# Altium schematic sheet schematics.SchDoc (part 1 of 3)
size A2
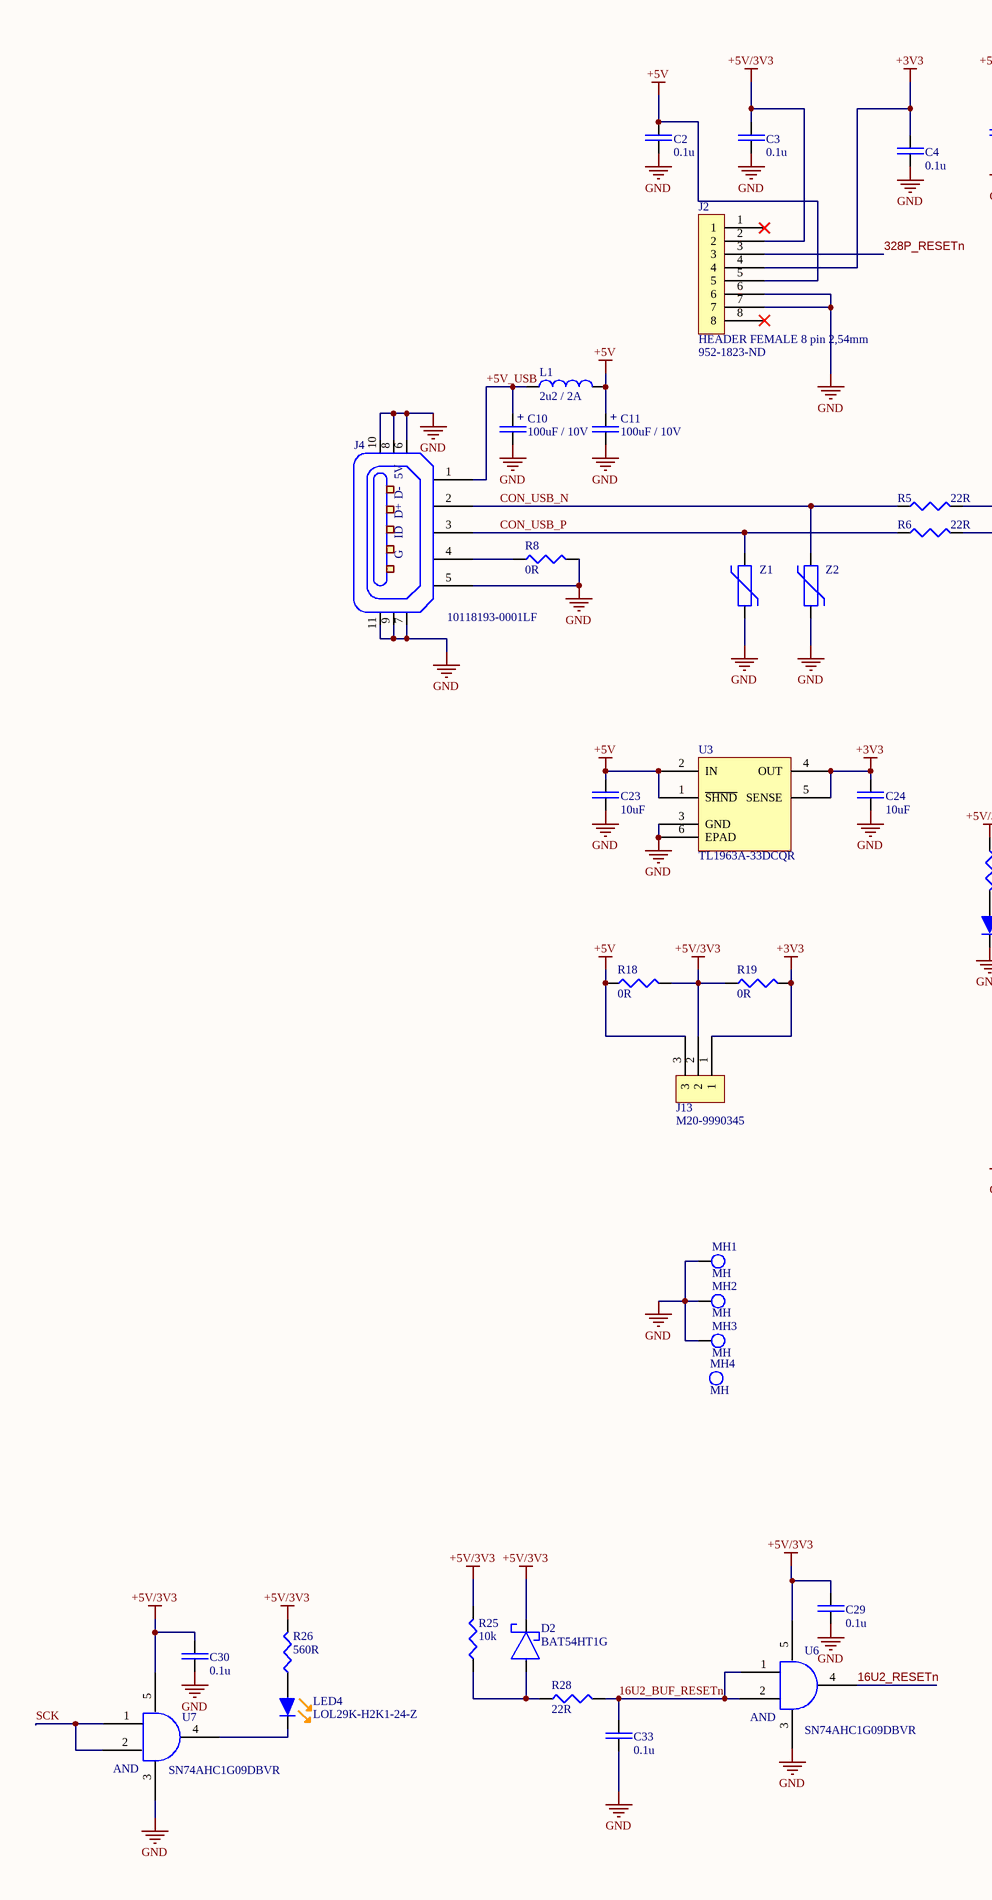
[diagram p0: schematics.SchDoc, left]
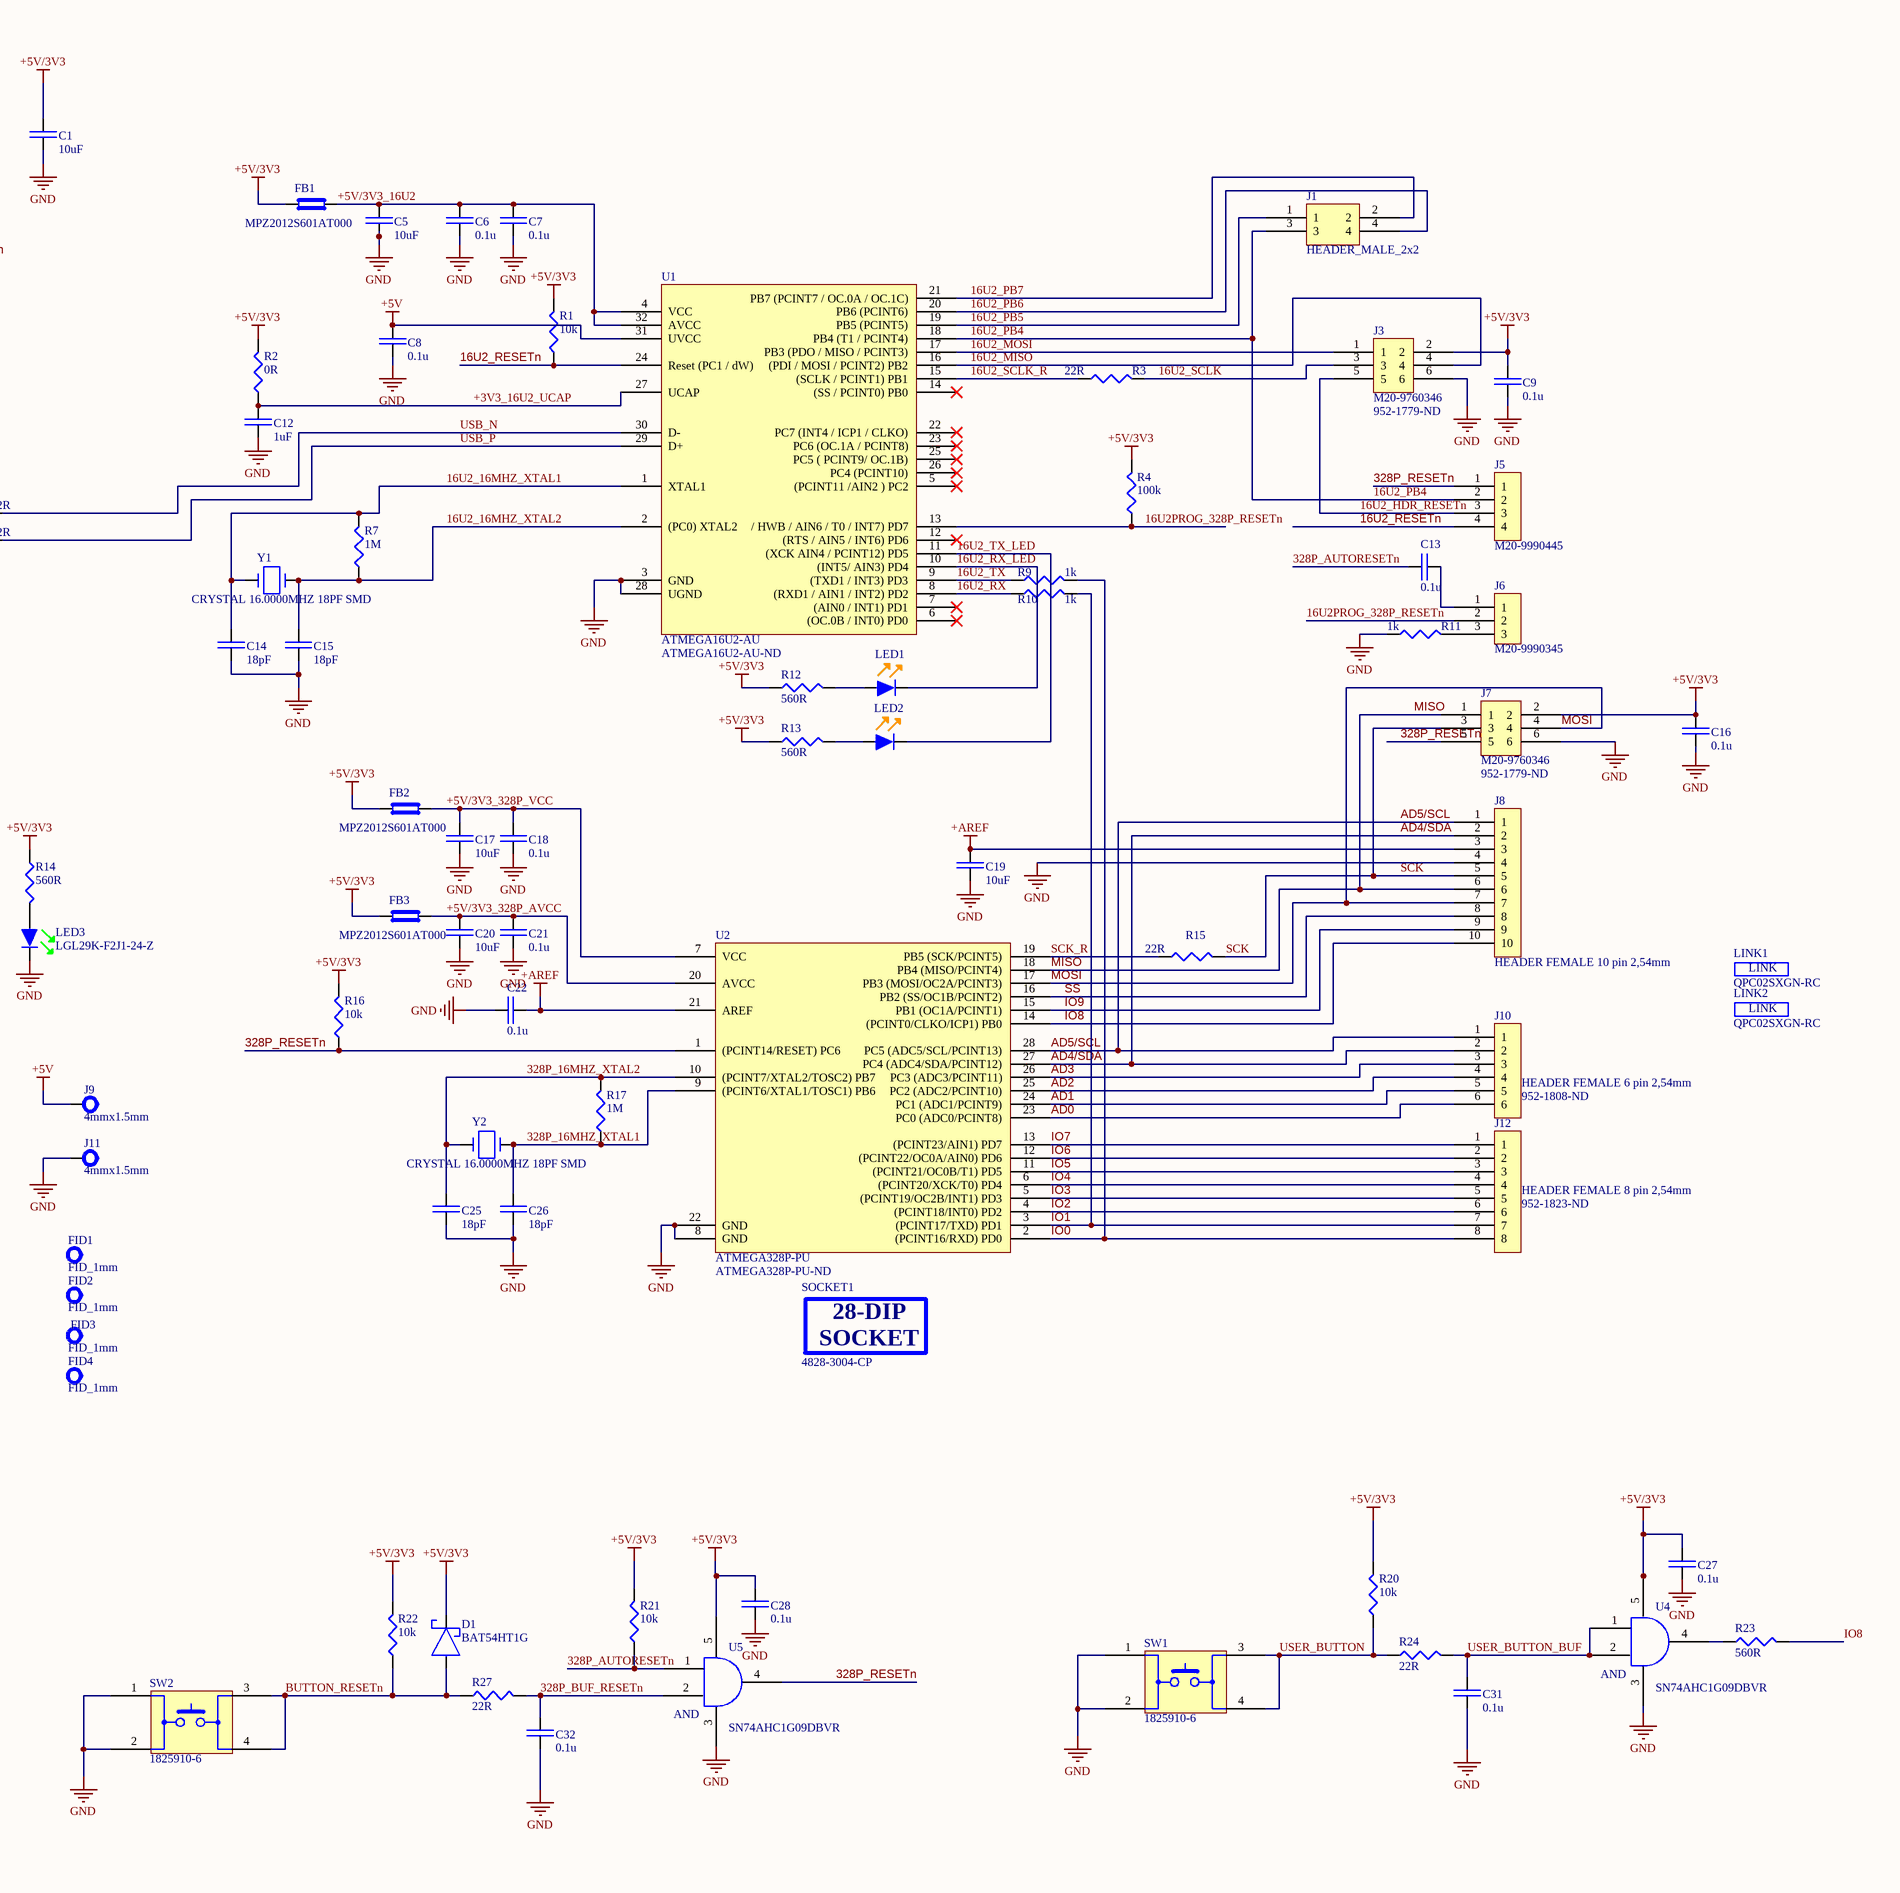
[diagram p1: schematics.SchDoc, right]

## Parts
C1  10uF  [CAP_0805]
C2  0.1u  [CAP_603]
C3  0.1u  [CAP_603]
C4  0.1u  [CAP_603]
C5  10uF  [CAP_0805]
C6  0.1u  [CAP_603]
C7  0.1u  [CAP_603]
C8  0.1u  [CAP_603]
C9  0.1u  [CAP_603]
C10  100uF / 10V  [EEE-1AA101WR]
C11  100uF / 10V  [EEE-1AA101WR]
C12  1uF  [CAP_603]
C13  0.1u  [CAP_603]
C14  18pF  [CAP_603]
C15  18pF  [CAP_603]
C16  0.1u  [CAP_603]
C17  10uF  [CAP_0805]
C18  0.1u  [CAP_603]
C19  10uF  [CAP_0805]
C20  10uF  [CAP_0805]
C21  0.1u  [CAP_603]
C22  0.1u  [CAP_603]
C23  10uF  [CAP_0805]
C24  10uF  [CAP_0805]
C25  18pF  [CAP_603]
C26  18pF  [CAP_603]
C27  0.1u  [CAP_603]
C28  0.1u  [CAP_603]
C29  0.1u  [CAP_603]
C30  0.1u  [CAP_603]
C31  0.1u  [CAP_603]
C32  0.1u  [CAP_603]
C33  0.1u  [CAP_603]
D1  BAT54HT1G  [BAT54HT1G]
D2  BAT54HT1G  [BAT54HT1G]
FB1  MPZ2012S601AT000  [FB_0805]
FB2  MPZ2012S601AT000  [FB_0805]
FB3  MPZ2012S601AT000  [FB_0805]
FID1  FID_1mm  [FID_1mm]  (no BOM)
FID2  FID_1mm  [FID_1mm]  (no BOM)
FID3  FID_1mm  [FID_1mm]  (no BOM)
FID4  FID_1mm  [FID_1mm]  (no BOM)
J1  HEADER_MALE_2x2  [HEADER_MALE_2x2PIN]
J2  HEADER FEMALE 8 pin 2,54mm  Supplier Part Number 1: 952-1823-ND  [HEADER_FEMALE_8PIN_2.54mm]
J3  M20-9760346  Supplier Part Number 1: 952-1779-ND  [HEADER_MALE_2x3PIN]
J4  10118193-0001LF  [10118193-0001LF]
J5  M20-9990445  [HEADER_MALE_1x4]
J6  M20-9990345  [HEADER_MALE_1x3]
J7  M20-9760346  Supplier Part Number 1: 952-1779-ND  [HEADER_MALE_2x3PIN]
J8  HEADER FEMALE 10 pin 2,54mm  [HEADER_FEMALE_10PIN_2.54mm]
J9  4mmx1.5mm  [PAD_WITH_HOLE_4mmx1.5mm]  (no BOM)
J10  HEADER FEMALE 6 pin 2,54mm  Supplier Part Number 1: 952-1808-ND  [HEADER_FEMALE_6PIN_2.54mm]
J11  4mmx1.5mm  [PAD_WITH_HOLE_4mmx1.5mm]  (no BOM)
J12  HEADER FEMALE 8 pin 2,54mm  Supplier Part Number 1: 952-1823-ND  [HEADER_FEMALE_8PIN_2.54mm]
J13  M20-9990345  [HEADER_MALE_1x3]
L1  2u2 / 2A  [L_1210]
LED1  LOL29K-H2K1-24-Z  [LED_0603]  (value not drawn)
LED2  LOL29K-H2K1-24-Z  [LED_0603]  (value not drawn)
LED3  LGL29K-F2J1-24-Z  [LED_0603]
LED4  LOL29K-H2K1-24-Z  [LED_0603]
LINK1  QPC02SXGN-RC  (mechanical)
LINK2  QPC02SXGN-RC  (mechanical)
MH1  MH  [MH_7.4mm_3,2MMD]  (no BOM)
MH2  MH  [MH_7.4mm_3,2MMD]  (no BOM)
MH3  MH  [MH_7.4mm_3,2MMD]  (no BOM)
MH4  MH  [MH_7.4mm_3,2MMD_nonplated]  (no BOM)
R1  10k  [R_0603]
R2  0R  [R_0603]
R3  22R  [R_0805]
R4  100k  [R_0603]
R5  22R  [R_0805]
R6  22R  [R_0805]
R7  1M  [R_0603]
R8  0R  [R_0603]
R9  1k  [R_0603]
R10  1k  [R_0603]
R11  1k  [R_0603]
R12  560R  [R_0603]
R13  560R  [R_0603]
R14  560R  [R_0603]
R15  22R  [R_0805]
R16  10k  [R_0603]
R17  1M  [R_0603]
R18  0R  [R_0603]
R19  0R  [R_0603]
R20  10k  [R_0603]
R21  10k  [R_0603]
R22  10k  [R_0603]
R23  560R  [R_0603]
R24  22R  [R_0805]
R25  10k  [R_0603]
R26  560R  [R_0603]
R27  22R  [R_0805]
R28  22R  [R_0805]
SOCKET1  4828-3004-CP  (mechanical)
SW1  1825910-6  [BUTTON]
SW2  1825910-6  [BUTTON]
U1  ATMEGA16U2-AU  Supplier Part Number 1: ATMEGA16U2-AU-ND  [TQFP32]
U2  ATMEGA328P-PU  Supplier Part Number 1: ATMEGA328P-PU-ND  [DIP28_7.62mm]
U3  TL1963A-33DCQR  [DCQ (R-PDSO-G6)]
U4  SN74AHC1G09DBVR  [SOT-23]
U5  SN74AHC1G09DBVR  [SOT-23]
U6  SN74AHC1G09DBVR  [SOT-23]
U7  SN74AHC1G09DBVR  [SOT-23]
Y1  CRYSTAL 16.0000MHZ 18PF SMD  [ABM7_v1_1_BIG]
Y2  CRYSTAL 16.0000MHZ 18PF SMD  [ABM7_v1_1_BIG]
Z1  CG0603MLC-05E  [CG0603MLC-05E]  (value not drawn)
Z2  CG0603MLC-05E  [CG0603MLC-05E]  (value not drawn)

## Nets
+3V3: C4.1 C24.2 J2.4 J13.1 R19.2 U3.4(OUT) U3.5(SENSE)
+5V: C2.1 C8.2 C11.1 C23.2 J2.5 J9.1 J13.3 L1.2 R18.1 U1.31(UVCC) U3.1(~{SHND}) U3.2(IN)
+5V/3V3: C1.2 C3.1 C9.2 C16.2 C27.1 C28.1 C29.1 C30.2 D1.1 D2.1 FB1.1 FB2.1 FB3.1 J2.2 J3.2 J7.2 J13.2 R1.2 R2.2 R4.2 R12.1 R13.1 R14.1 R16.2 R18.2 R19.1 R20.2 R21.2 R22.2 R25.2 R26.2 U4.5 U5.5 U6.5 U7.5
+AREF: C19.2 C22.2 J8.3 U2.21(AREF)
GND: C1.1 C2.2 C3.2 C4.2 C5.1 C6.1 C7.1 C8.1 C9.1 C10.2 C11.2 C12.1 C14.1 C15.1 C16.1 C17.1 C18.1 C19.1 C20.1 C21.1 C22.1 C23.1 C24.1 C25.1 C26.1 C27.2 C28.2 C29.2 C30.1 C31.1 C32.1 C33.1 J2.6 J2.7 J3.6 J4.5 J4.6 J4.7 J4.8 J4.9 J4.10 J4.11 J7.6 J8.4 J11.1 LED3.1 MH1.1 MH2.1 MH3.1 R8.2 R11.1 SW1.1 SW1.2 SW2.1 SW2.2 U1.3(GND) U1.28(UGND) U2.8(GND) U2.22(GND) U3.3(GND) U3.6(EPAD) U4.3 U5.3 U6.3 U7.3 Z1.1 Z2.1
16U2_16MHZ_XTAL1: C14.2 R7.2 U1.1(XTAL1) Y1.1
16U2_16MHZ_XTAL2: C15.2 R7.1 U1.2((PC0)_XTAL2) Y1.2
16U2_BUF_RESETn: C33.2 R28.2 U6.1 U6.2
16U2_HDR_RESETn: J3.5 J5.3
16U2_MISO: J3.4 U1.16((PDI_/_MOSI_/_PCINT2)_PB2)
16U2_MOSI: J3.1 U1.17(PB3_(PDO_/_MISO_/_PCINT3))
16U2_PB4: J1.3 J5.2 U1.18(PB4_(T1_/_PCINT4))
16U2_PB5: J1.1 U1.19(PB5_(PCINT5))
16U2_PB6: J1.4 U1.20(PB6_(PCINT6))
16U2_PB7: J1.2 U1.21(PB7_(PCINT7_/_OC.0A_/_OC.1C))
16U2_RESETn: J5.4 R1.1 U1.24(Reset_(PC1_/_dW)) U6.4
16U2_RX: R10.1 U1.8((RXD1_/_AIN1_/_INT2)_PD2)
16U2_RX_LED: LED1.1 U1.10((INT5/_AIN3)_PD4)
16U2_SCLK: J3.3 R3.2
16U2_SCLK_R: R3.1 U1.15((SCLK_/_PCINT1)_PB1)
16U2_TX: R9.1 U1.9((TXD1_/_INT3)_PD3)
16U2_TX_LED: LED2.1 U1.11((XCK_AIN4_/_PCINT12)_PD5)
16U2PROG_328P_RESETn: J6.2 R4.1 U1.13(/_HWB_/_AIN6_/_T0_/_INT7)_PD7)
328P_16MHZ_XTAL1: C26.2 R17.1 U2.9((PCINT6/XTAL1/TOSC1)_PB6) Y2.2
328P_16MHZ_XTAL2: C25.2 R17.2 U2.10((PCINT7/XTAL2/TOSC2)_PB7) Y2.1
328P_AUTORESETn: C13.1 R21.1 U5.1
328P_BUF_RESETn: C32.2 R27.2 U5.2
328P_RESETn: J2.3 J5.1 J7.5 R16.1 U2.1((PCINT14/RESET)_PC6) U5.4
+3V3_16U2_UCAP: C12.2 R2.1 U1.27(UCAP)
+5V/3V3_16U2: C5.2 C6.2 C7.2 FB1.2 U1.4(VCC) U1.32(AVCC)
+5V/3V3_328P_AVCC: C20.2 C21.2 FB3.2 U2.20(AVCC)
+5V/3V3_328P_VCC: C17.2 C18.2 FB2.2 U2.7(VCC)
+5V_USB: C10.1 J4.1 L1.1
AD0: J10.6 U2.23(PC0_(ADC0/PCINT8))
AD1: J10.5 U2.24(PC1_(ADC1/PCINT9))
AD2: J10.4 U2.25(PC2_(ADC2/PCINT10))
AD3: J10.3 U2.26(PC3_(ADC3/PCINT11))
AD4/SDA: J8.2 J10.2 U2.27(PC4_(ADC4/SDA/PCINT12))
AD5/SCL: J8.1 J10.1 U2.28(PC5_(ADC5/SCL/PCINT13))
BUTTON_RESETn: D1.2 R22.1 R27.1 SW2.3 SW2.4
CON_USB_N: J4.2 R5.1 Z2.2
CON_USB_P: J4.3 R6.1 Z1.2
IO0: J12.8 R9.2 U2.2((PCINT16/RXD)_PD0)
IO1: J12.7 R10.2 U2.3((PCINT17/TXD)_PD1)
IO2: J12.6 U2.4((PCINT18/INT0)_PD2)
IO3: J12.5 U2.5((PCINT19/OC2B/INT1)_PD3)
IO4: J12.4 U2.6((PCINT20/XCK/T0)_PD4)
IO5: J12.3 U2.11((PCINT21/OC0B/T1)_PD5)
IO6: J12.2 U2.12((PCINT22/OC0A/AIN0)_PD6)
IO7: J12.1 U2.13((PCINT23/AIN1)_PD7)
IO8: J8.10 R23.2 U2.14((PCINT0/CLKO/ICP1)_PB0)
IO9: J8.9 U2.15(PB1_(OC1A/PCINT1))
MISO: J7.1 J8.6 U2.18(PB4_(MISO/PCINT4))
MOSI: J7.4 J8.7 U2.17(PB3_(MOSI/OC2A/PCINT3))
SCK: J7.3 J8.5 R15.2 U7.1 U7.2
SCK_R: R15.1 U2.19(PB5_(SCK/PCINT5))
SS: J8.8 U2.16(PB2_(SS/OC1B/PCINT2))
USB_N: R5.2 U1.30(D-)
USB_P: R6.2 U1.29(D+)
USER_BUTTON: R20.1 R24.1 SW1.3 SW1.4
USER_BUTTON_BUF: C31.2 R24.2 U4.1 U4.2
NetC13_2: C13.2 J6.1
NetD2_2: D2.2 R25.1 R28.1
NetJ4_4: J4.4 R8.1
NetJ6_3: J6.3 R11.2
NetLED1_2: LED1.2 R12.2
NetLED2_2: LED2.2 R13.2
NetLED3_2: LED3.2 R14.2
NetLED4_1: LED4.1 U7.4
NetLED4_2: LED4.2 R26.1
NetR23_1: R23.1 U4.4

Not connected (* = marked no-connect by the designer): J2 1* 8*; U1 5((PCINT11_/AIN2_)_PC2)* 6((OC.0B_/_INT0)_PD0)* 7((AIN0_/_INT1)_PD1)* 12((RTS_/_AIN5_/_INT6)_PD6)* 14((SS_/_PCINT0)_PB0)* 22(PC7_(INT4_/_ICP1_/_CLKO))* 23(PC6_(OC.1A_/_PCINT8))* 25(PC5_(_PCINT9/_OC.1B))* 26(PC4_(PCINT10))*